# Altium schematic sheet Wirelesscharging.SchDoc
size A4
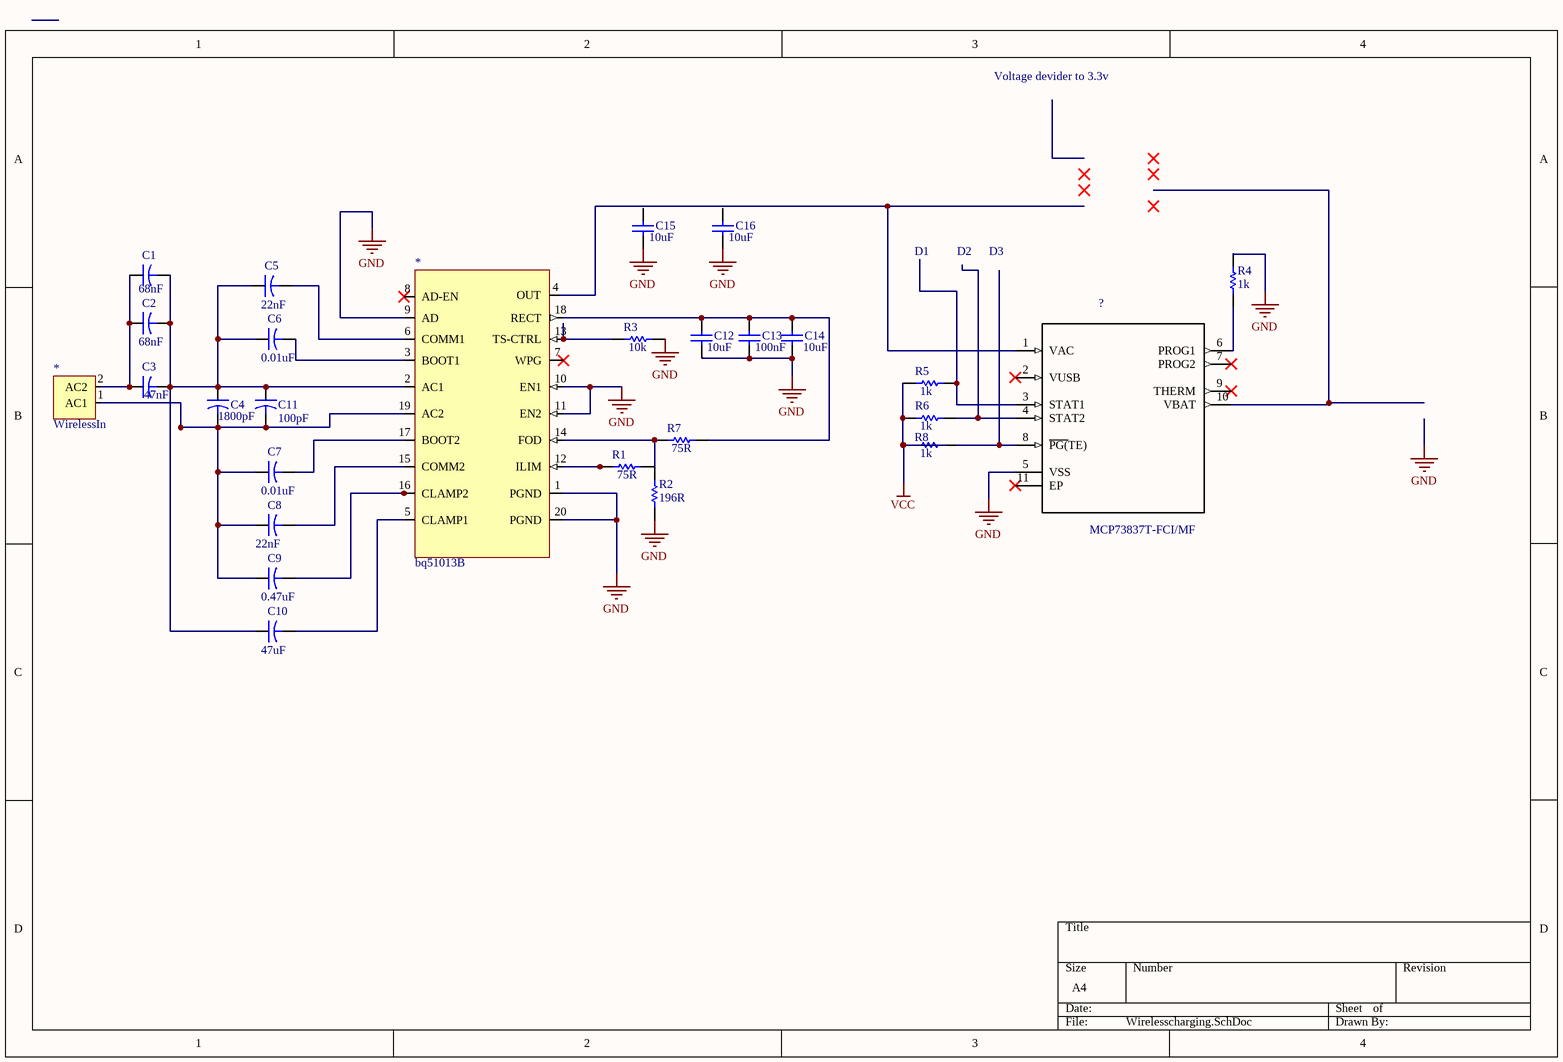
[diagram p0: Wirelesscharging.SchDoc]

## Parts
(Parts that share a designator on the sheet are numbered #1, #2 ... from top to bottom, then left to right.)
*#1  WirelessIn  [WirelessIn]
*#2  bq51013B  [CONTROLLER_MSP430FR2522IRHLT]
?  MCP73837T-FCI/MF  [DFN300X300X100-11N]
C1  value 68nF  [CAPR5-4X5]  (hidden comment: Cap2)
C2  value 68nF  [CAPR5-4X5]  (hidden comment: Cap2)
C3  value 47nF  [CAPR5-4X5]  (hidden comment: Cap2)
C4  value 1800pF  [CAPR5-4X5]  (hidden comment: Cap2)
C5  value 22nF  [CAPR5-4X5]  (hidden comment: Cap2)
C6  value 0.01uF  [CAPR5-4X5]  (hidden comment: Cap2)
C7  value 0.01uF  [CAPR5-4X5]  (hidden comment: Cap2)
C8  value 22nF  [CAPR5-4X5]  (hidden comment: Cap2)
C9  value 0.47uF  [CAPR5-4X5]  (hidden comment: Cap2)
C10  value 47uF  [CAPR5-4X5]  (hidden comment: Cap2)
C11  value 100pF  [CAPR5-4X5]  (hidden comment: Cap2)
C12  value 10uF  [RAD-0.3]  (hidden comment: Cap)
C13  value 100nF  [RAD-0.3]  (hidden comment: Cap)
C14  value 10uF  [RAD-0.3]  (hidden comment: Cap)
C15  value 10uF  [RAD-0.3]  (hidden comment: Cap)
C16  value 10uF  [RAD-0.3]  (hidden comment: Cap)
R1  value 75R  [AXIAL-0.3]  (hidden comment: Res1)
R2  value 196R  [AXIAL-0.3]  (hidden comment: Res1)
R3  value 10k  [AXIAL-0.3]  (hidden comment: Res1)
R4  value 1k  [AXIAL-0.3]  (hidden comment: Res1)
R5  value 1k  [AXIAL-0.3]  (hidden comment: Res1)
R6  value 1k  [AXIAL-0.3]  (hidden comment: Res1)
R7  value 75R  [AXIAL-0.3]  (hidden comment: Res1)
R8  value 1k  [AXIAL-0.3]  (hidden comment: Res1)

## Nets
GND: *#2.1(PGND) *#2.9(AD) *#2.10(EN1) *#2.11(EN2) *#2.20(PGND) ?.5(VSS) C12.1 C13.1 C14.1 C15.1 C16.1 R2.1 R3.2 R4.2
VCC: R5.1 R6.1 R8.1
Net*#1_1: *#1.1(AC1) *#2.19(AC2) C4.2 C7.1 C8.1 C9.1 C11.2
Net*#1_2: *#1.2(AC2) C1.1 C2.1 C3.1
Net*#2_2: *#2.2(AC1) C1.2 C2.2 C3.2 C4.1 C5.1 C6.1 C10.1 C11.1
Net*#2_3: *#2.3(BOOT1) C6.2
Net*#2_4: *#2.4(OUT) ?.1(VAC)
Net*#2_5: *#2.5(CLAMP1) C10.2
Net*#2_6: *#2.6(COMM1) C5.2
Net*#2_12: *#2.12(ILIM) R1.1
Net*#2_13: *#2.13(TS-CTRL) R3.1
Net*#2_14: *#2.14(FOD) R2.2 R7.1
Net*#2_15: *#2.15(COMM2) C8.2
Net*#2_16: *#2.16(CLAMP2) C9.2
Net*#2_17: *#2.17(BOOT2) C7.2
Net*#2_18: *#2.18(RECT) C12.2 C13.2 C14.2 R7.2
Net?_3: ?.3(STAT1) R5.2
Net?_4: ?.4(STAT2) R6.2
Net?_6: ?.6(PROG1) R4.1
Net?_8: ?.8(~{PG(}TE)) R8.2

Not connected (* = marked no-connect by the designer): *#2 7(WPG)* 8(AD-EN)*; ? 2(VUSB)* 7(PROG2)* 9(THERM)* 10(VBAT) 11(EP)*; C15 2; C16 2; R1 2

## Notes on the sheet
- Voltage devider to 3.3v
- D1
- D2
- D3
- (in symbol MCP73837T-FCI/MF) Text

## Library data of the parts
? = MCP73837T-FCI/MF: MCP73837 Series 6 V Linear Battery Charge Controller Surface Mount - DFN-10; MF: Microchip; Package: DFN-10 Microchip; SnapEDA_Link: https://www.snapeda.com/symbols-footprints/MCP73837T-FCI/MF/Microchip/view-part/?ref=snap; MP: MCP73837T-FCI/MF; Availability: Good; Price: 0.98 USD; Value: *
C1-C11 = Cap2: Capacitor; Published: 23-Sep-2002; PackageReference: CAPR5-4X5; Publisher: Altium Limited; PackageDescription: Capacitor; 2 Leads
C12-C16 = Cap: Capacitor; Published: 8-Jun-2000; LatestRevisionDate: 17-Jul-2002; LatestRevisionNote: Re-released for DXP Platform.; PackageReference: RAD-0.3; Publisher: Altium Limited; PackageDescription: Radial Cap, Thru-Hole; 2 Leads; 0.3 in Pin Spacing
R1-R8 = Res1: Resistor; Published: 8-Jun-2000; LatestRevisionDate: 17-Jul-2002; LatestRevisionNote: Re-released for DXP Platform.; PackageReference: AXIAL-0.3; Publisher: Altium Limited; PackageDescription: Axial Device, Thru-Hole; 2 Leads; 0.3 in Pin Spacing